# EAGLE design RFmodule (EAGLE 9.6.2)
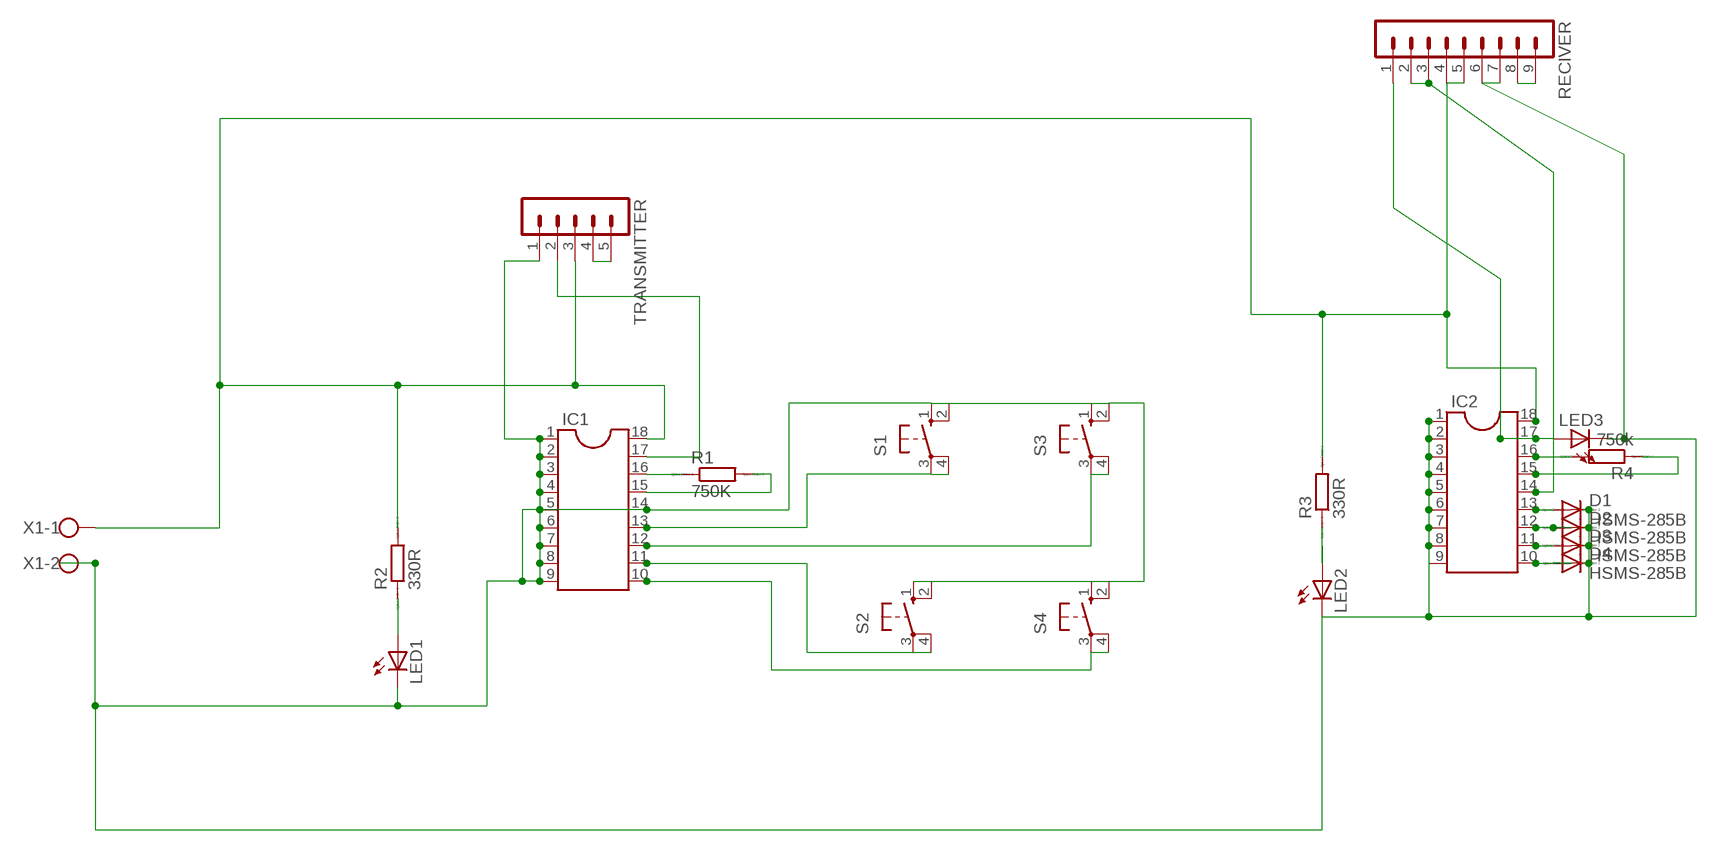
[diagram p0: schematic, sheet 1]

## Parts
D1  HSMS-285B  [SOT323]
D2  HSMS-285B  [SOT323]
D3  HSMS-285B  [SOT323]
D4  HSMS-285B  [SOT323]
IC1  DIL18  [DIL18]
IC2  DIL18  [DIL18]
LED1  LED5MM  [LED5MM]
LED2  LED5MM  [LED5MM]
LED3  LED5MM  [LED5MM]
R1  750K  R0207/10  [0207/10]
R2  330R  R0207/10  [0207/10]
R3  330R  R0204/7  [0204/7]
R4  750k  R0204/7  [0204/7]
RECIVER  MA09-1  [MA09-1]
S1  10-XX  [B3F-10XX]
S2  10-XX  [B3F-10XX]
S3  10-XX  [B3F-10XX]
S4  10-XX  [B3F-10XX]
TRANSMITTER  MA05-1  [MA05-1]
X1  W237-102  [W237-102]

## Nets
GND: D1.3(C) D2.3(C) D3.3(C) D4.3(C) IC1.1 IC1.2 IC1.3 IC1.4 IC1.5 IC1.6 IC1.7 IC1.8 IC1.9 IC1.14 IC2.1 IC2.2 IC2.3 IC2.4 IC2.5 IC2.6 IC2.7 IC2.8 IC2.9 LED1.K(C) LED2.K(C) LED3.K(C) RECIVER.6 RECIVER.7 S1.1(S) S1.2(S1) S2.1(S) S2.2(S1) S3.1(S) S3.2(S1) S4.1(S) S4.2(S1) TRANSMITTER.1 X1.2
N$1: LED2.A R3.1
N$2: IC1.13 S1.3(P) S1.4(P1)
N$3: LED1.A R2.1
N$4: IC1.16 R1.1
N$5: IC1.15 R1.2
N$6: IC1.11 S2.3(P) S2.4(P1)
N$8: D1.1(A) IC2.13
N$9: IC1.10 S4.3(P) S4.4(P1)
N$10: IC1.12 S3.3(P) S3.4(P1)
N$11: D2.1(A) IC2.12
N$12: D3.1(A) IC2.11
N$13: D4.1(A) IC2.10
N$14: TRANSMITTER.4 TRANSMITTER.5
N$15: IC1.17 TRANSMITTER.2
N$16: RECIVER.8 RECIVER.9
N$17: IC2.17 LED3.A RECIVER.1
N$18: IC2.16 R4.2
N$19: IC2.15 R4.1
N$21: IC2.14 RECIVER.2 RECIVER.3
VCC: IC1.18 IC2.18 R2.2 R3.2 RECIVER.4 RECIVER.5 TRANSMITTER.3 X1.1

## Library data of the parts
D1-D4 = avago:HSMS-285B: Surface Mount Microwave Schottky Detector Diodes Source: Data sheet <http://www.farnell.com/datasheets/461166.pdf>
IC1 IC2 = ic-package:DIL18: Dual In Line / Socket
LED1-LED3 = led:LED: LED OSRAM: - CHIPLED LG R971, LG N971, LY N971, LG Q971, LY Q971, LO R971, LY R971 LH N974, LH R974 LS Q976, LO Q976, LY Q976 LO Q996 - Hyper CHIPLED LW Q18S LB Q993, LB Q99A, LB R99A - SideLED LS A670, LO A670, LY A670, LG A670, LP A670 LB A673, LV A673, LT A673, LW A673 LH A674 LY A675 LS A676, LA A676, LO A676, LY A676, LW A676 LS A679, LY A679, LG A679 - Hyper Micro SIDELED® LS Y876, LA Y876, LO Y876, LY Y876 LT Y87S - SmartLED LW L88C, LW L88S LB L89C, LB L89S, LG L890 LS L89K, LO L89K, LY L89K LS L896, LA L896, LO L896, LY L896 - TOPLED LS T670, LO T670, LY T670, LG T670, LP T670 LSG T670, LSP T670, LSY T670, LOP T670, LYG T670 LG T671, LOG T671, LSG T671 LB T673, LV T673, LT T673, LW T673 LH T674 LS T676, LA T676, LO T676, LY T676, LB T676, LH T676, LSB T676, LW T676 LB T67C, LV T67C, LT T67C, LS T67K, LO T67K, LY T67K, LW E67C LS E67B, LA E67B, LO E67B, LY E67B, LB E67C, LV E67C, LT E67C LW T67C LS T679, LY T679, LG T679 LS T770, LO T770, LY T770, LG T770, LP T770 LB T773, LV T773, LT T773, LW T773 LH T774 LS E675, LA E675, LY E675, LS T675 LS T776, LA T776, LO T776, LY T776, LB T776 LHGB T686 LT T68C, LB T68C - Hyper Mini TOPLED® LB M676 - Mini TOPLED Santana® LG M470 LS M47K, LO M47K, LY M47K Source: http://www.osram.convergy.de LUXEON: - LUMILED® LXK2-PW12-R00, LXK2-PW12-S00, LXK2-PW14-U00, LXK2-PW14-V00 LXK2-PM12-R00, LXK2-PM12-S00, LXK2-PM14-U00 LXK2-PE12-Q00, LXK2-PE12-R00, LXK2-PE12-S00, LXK2-PE14-T00, LXK2-PE14-U00 LXK2-PB12-K00, LXK2-PB12-L00, LXK2-PB12-M00, LXK2-PB14-N00, LXK2-PB14-P00, LXK2-PB14-Q00 LXK2-PR12-L00, LXK2-PR12-M00, LXK2-PR14-Q00, LXK2-PR14-R00 LXK2-PD12-Q00, LXK2-PD12-R00, LXK2-PD12-S00 LXK2-PH12-R00, LXK2-PH12-S00 LXK2-PL12-P00, LXK2-PL12-Q00, LXK2-PL12-R00 Source: www.luxeon.com KINGBRIGHT: KA-3528ASYC Source: www.kingbright.com
R1-R4 = eagle-ltspice:R: RESISTOR, European symbol; SPICEMODEL: NONE; SPICEPREFIX: R
RECIVER = con-lstb:MA09-1: PIN HEADER; OC_FARNELL: unknown; OC_NEWARK: unknown
S1-S4 = switch-omron:10-XX: OMRON SWITCH; MPN: B3F-1000; OC_FARNELL: 176432; OC_NEWARK: 36M3542
TRANSMITTER = con-lstb:MA05-1: PIN HEADER; OC_FARNELL: unknown; OC_NEWARK: unknown
X1 = con-wago-500:W237-102: WAGO SCREW CLAMP; MPN: 237-102; OC_FARNELL: unknown; OC_NEWARK: 70K9898

## Board
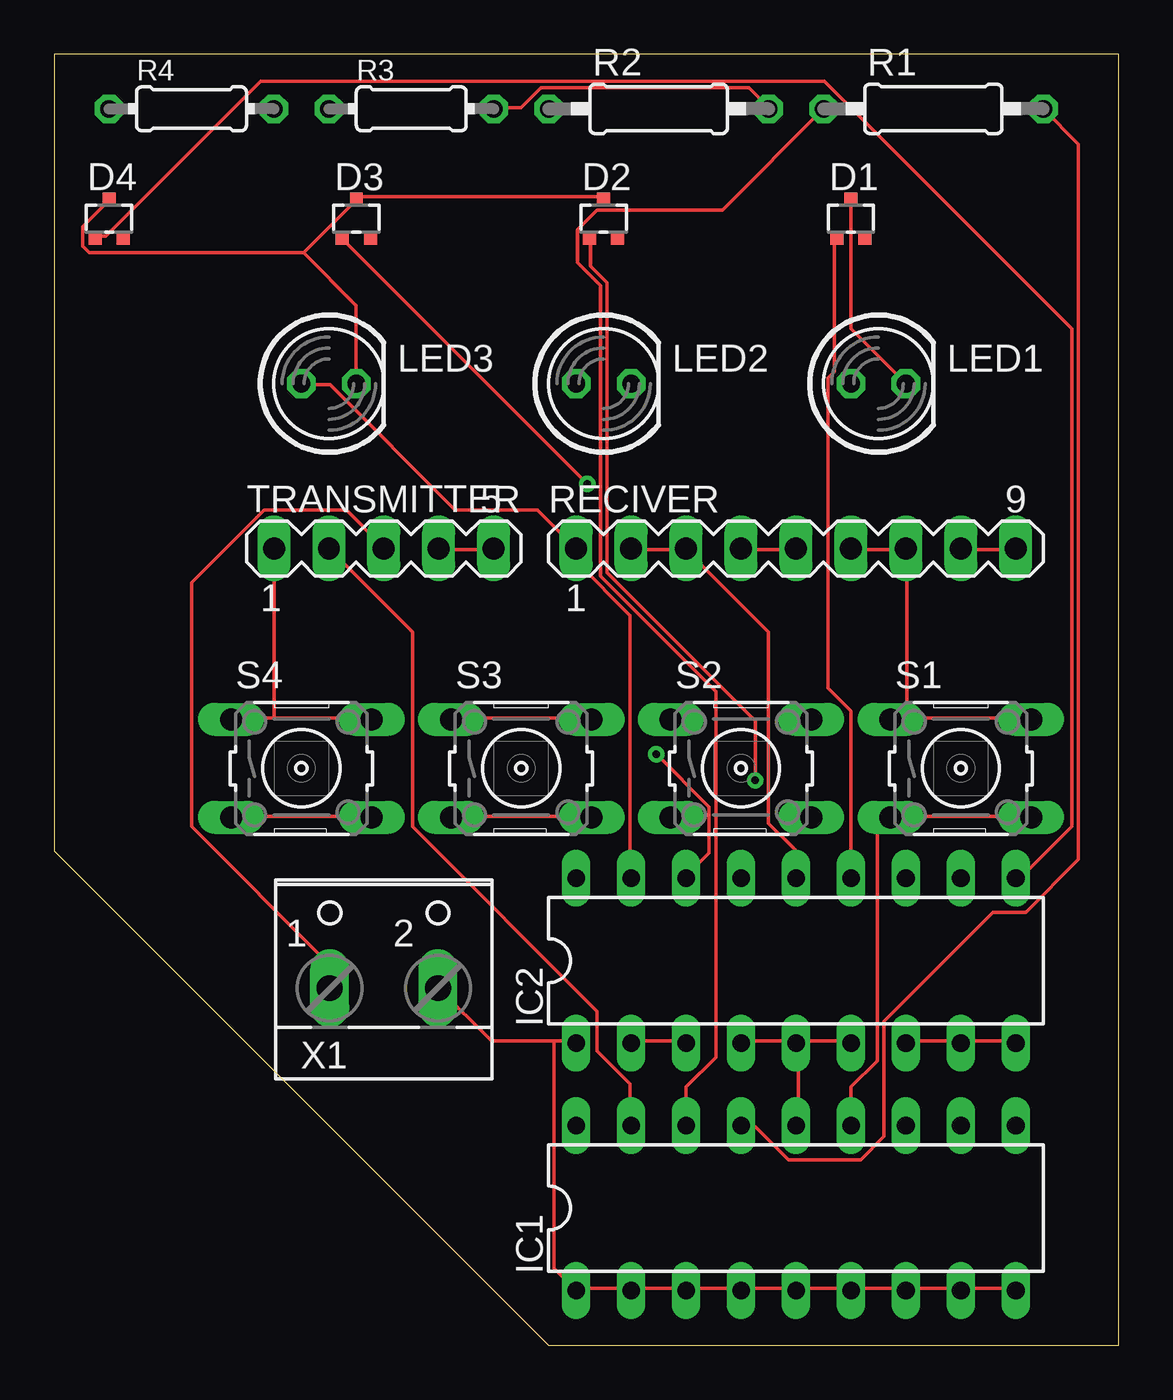
[diagram p1: board, top side]
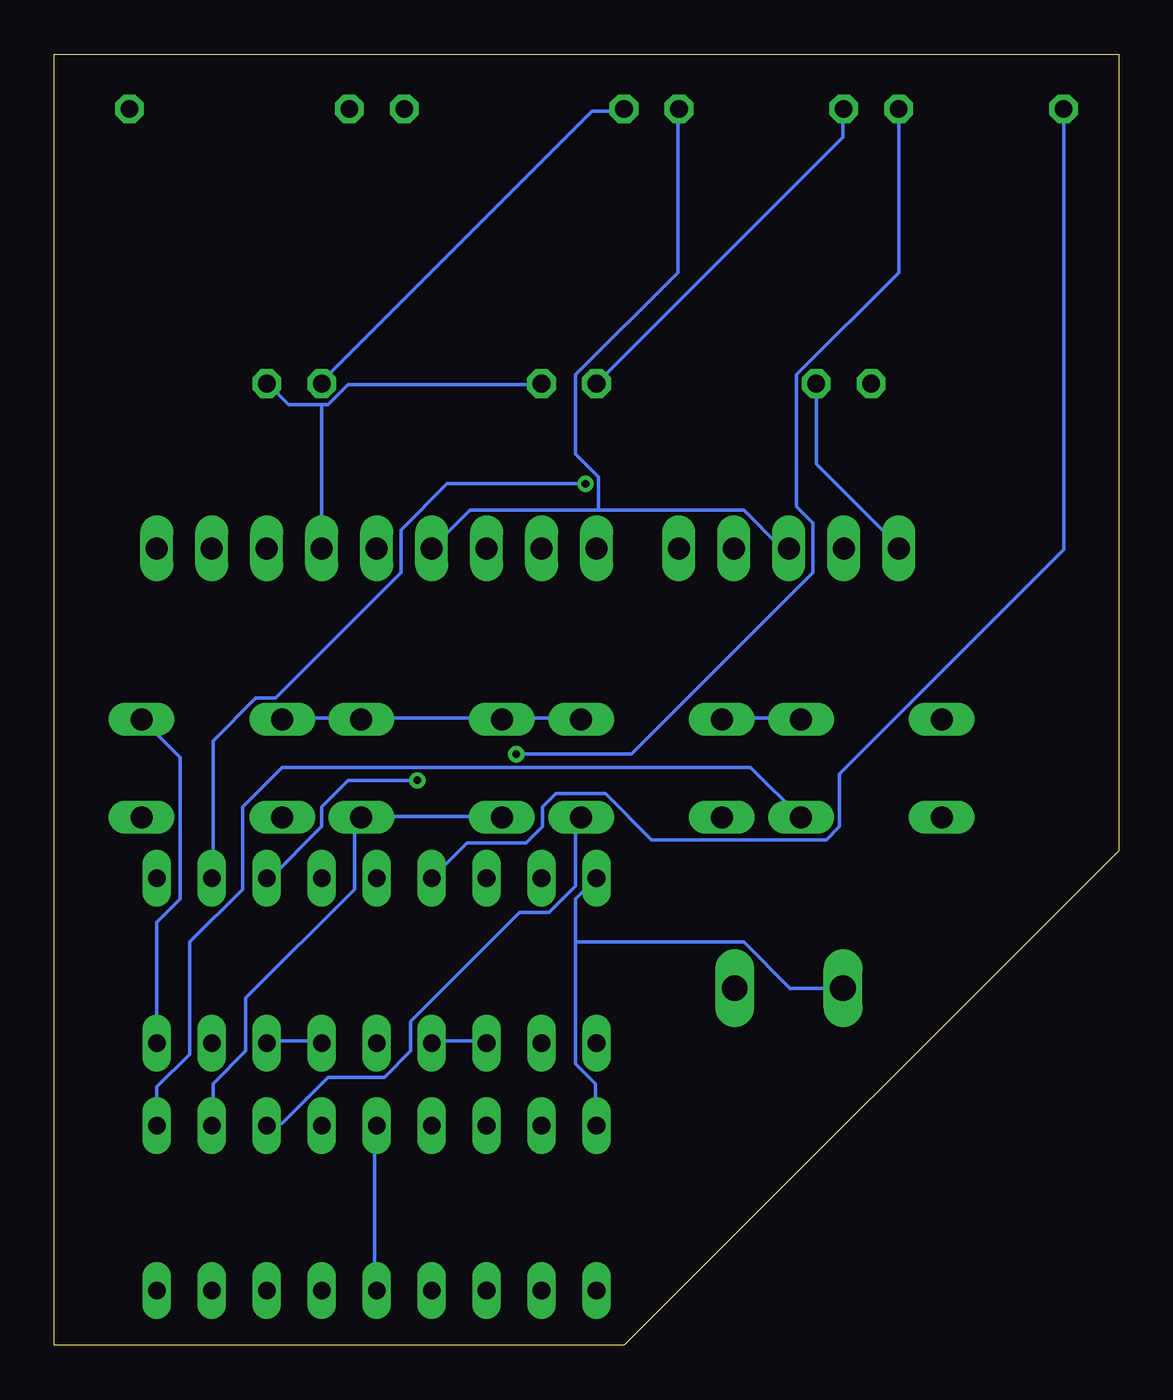
[diagram p2: board, bottom side, seen from below]

Size 49.2 x 59.68 mm. Coordinates in mm from the lower left corner, seen from the top.
Outline: 49.2,0 49.2,59.68 0,59.68 0,22.86 22.86,0 49.2,0
Copper layers (1*16): Top 0.035mm / dielectric 1.5mm / Bottom 0.035mm
Design rules "default": minimum track width 6mil, minimum drill 0.35mm, track to track 6mil, track to pad 6mil, pad to pad 6mil, via to via 6mil, smd to smd 6mil, copper to edge 40mil, drill to drill 6mil, minimum pad ring 10mil, minimum via ring 8mil, stop-mask expansion 4mil, vias tented up to drill 0mil, thermal gap 10mil

### Footprints (pad centres in the part's own frame; a part is rotated, then mirrored left to right if it is on the bottom)
SOT323 = smd 0.6 x 0.55: 1 -0.65,-0.925; 2 0.65,-0.925; 3 0,0.925
DIL18 = drill 0.813 long: 1 -10.16,-3.81; 2 -7.62,-3.81; 3 -5.08,-3.81; 4 -2.54,-3.81; 5 0,-3.81; 6 2.54,-3.81; 7 5.08,-3.81; 8 7.62,-3.81; 9 10.16,-3.81; 10 10.16,3.81; 11 7.62,3.81; 12 5.08,3.81; 13 2.54,3.81; 14 0,3.81; 15 -2.54,3.81; 16 -5.08,3.81; 17 -7.62,3.81; 18 -10.16,3.81
LED5MM = drill 0.813 octagon: A -1.27,0; K 1.27,0
0207/10 = drill 0.813 octagon: 1 -5.08,0; 2 5.08,0
0204/7 = drill 0.813 octagon: 1 -3.81,0; 2 3.81,0
MA09-1 = drill 1.016 long: 1 -10.16,0; 2 -7.62,0; 3 -5.08,0; 4 -2.54,0; 5 0,0; 6 2.54,0; 7 5.08,0; 8 7.62,0; 9 10.16,0
B3F-10XX = drill 1.016 long: 1 -3.251,2.261; 2 3.251,2.261; 3 -3.251,-2.261; 4 3.251,-2.261
MA05-1 = drill 1.016 long: 1 -5.08,0; 2 -2.54,0; 3 0,0; 4 2.54,0; 5 5.08,0
W237-102 = drill 1.194 long: 1 -2.5,-1.27; 2 2.5,-1.27

### Placement (x,y rotation side)
D1  36.83,52.07 0 top
D2  25.4,52.07 0 top
D3  13.97,52.07 0 top
D4  2.54,52.07 0 top
IC1  34.29,6.35 0 top
IC2  34.29,17.78 0 top
LED1  38.1,44.45 0 top
LED2  25.4,44.45 0 top
LED3  12.7,44.45 0 top
R1  40.64,57.15 0 top
R2  27.94,57.15 0 top
R3  16.51,57.15 0 top
R4  6.35,57.15 0 top
RECIVER  34.29,36.83 0 top
S1  41.91,26.67 0 top
S2  31.75,26.67 0 top
S3  21.59,26.67 0 top
S4  11.43,26.67 0 top
TRANSMITTER  15.24,36.83 0 top
X1  15.24,17.78 0 top

### Tracks (layer width: path | path; a pad name or v marks a point on that pad's centre or on a via)
GND
  Top 0.152: IC2.7 39.42,14.07 41.86,14.07 IC2.8 42.01,14.07 44.45,14.07 IC2.9 | IC2.2 26.77,14.07 29.21,14.07 IC2.3 | IC1.14 34.39,10.26 34.39,13.92 IC2.5 | IC2.4 31.8,14.07 34.24,14.07 IC2.5 | IC2.6 36.83,14.07 34.39,14.07 IC2.5 | 23.11,14.07 20.22,14.07 17.78,16.51 X1.2 | 23.11,14.07 24.03,14.07 IC2.1 | IC1.9 44.45,2.64 42.01,2.64 IC1.8 41.86,2.64 39.42,2.64 IC1.7 39.27,2.64 36.83,2.64 | 29.21,2.64 26.77,2.64 IC1.2 26.62,2.64 24.18,2.64 IC1.1 23.11,3.56 23.11,14.07 | 36.83,2.64 34.39,2.64 IC1.5 34.24,2.64 31.8,2.64 IC1.4 31.65,2.64 29.21,2.64 | 29.21,2.64 IC1.3 | 36.83,2.64 IC1.6 | RECIVER.6 36.83,36.78 39.27,36.78 RECIVER.7 39.42,36.78 39.42,29.01 | D1.3 36.83,46.99 LED1.K | 11.53,50.49 1.63,50.49 1.32,50.8 1.32,51.71 2.54,52.93 D4.3 | 11.53,50.49 13.97,52.93 D3.3 13.97,53.09 25.4,53.09 D2.3 | LED3.K 13.97,48.06 11.53,50.49 | 39.42,29.01 38.66,29.01 S1.1 39.42,29.01 | 39.42,29.01 45.06,29.01 S1.2 | 10.16,29.01 14.58,29.01 S4.2 | 10.16,29.01 8.18,29.01 S4.1 | 10.16,29.01 TRANSMITTER.1 | S3.2 24.79,29.01 18.39,29.01 S3.1
  Bottom 0.152: IC2.3 29.21,14.07 31.65,14.07 IC2.4 | IC2.7 39.27,14.07 36.83,14.07 IC2.6 | IC1.14 34.39,10.11 34.39,2.64 IC1.5 | 36.83,43.49 38.35,43.49 39.27,44.4 LED1.K | 36.83,43.49 36.52,43.49 35.61,44.4 26.77,44.4 LED2.K | 36.83,43.49 RECIVER.6 | 35,29.01 38.66,29.01 S1.1 | S3.2 24.94,29.01 28.45,29.01 S2.1 28.6,29.01 35,29.01 | S3.1 18.24,29.01 14.73,29.01 S4.2 | 35,29.01 S2.2 | LED3.K 13.97,40.74 10.16,36.93 TRANSMITTER.1 | IC2.9 44.45,19.56 43.38,20.62 43.38,27.18 45.06,28.85 S1.2
N$1
  Bottom 0.152: LED2.A 12.75,55.83 12.75,57.05 R3.1
N$2
  Top 0.152: IC1.13 36.83,11.94 38.05,13.16 38.05,23.67 38.66,24.28 S1.3 38.66,24.43 45.06,24.43 S1.4
N$3
  Bottom 0.152: R2.1 22.96,57.05 24.33,57.05 36.83,44.55 LED1.A
N$4
  Top 0.152: IC1.16 29.21,11.94 30.58,13.31 30.58,30.23 25.25,35.56 25.25,48.97 24.18,50.04 24.18,51.56 25.09,52.48 30.89,52.48 R1.1
N$5
  Top 0.152: R1.2 47.35,55.52 47.35,22.45 44.91,20.02 43.38,20.02 38.35,14.99 38.35,9.65 37.29,8.59 33.93,8.59 32.41,10.11 31.8,10.11 IC1.15
N$6
  Bottom 0.152: IC1.11 41.86,10.26 41.86,12.09 40.34,13.61 40.34,16.05 35.31,21.08 35.31,23.98 35,24.28 S2.4 35,24.43 28.6,24.43 S2.3
N$8
  Top 0.152: IC2.13 36.83,29.31 35.76,30.38 35.76,44.7 36.07,45.01 36.07,51.1 D1.1
N$9
  Top 0.152: S4.3 8.18,24.43 14.58,24.43 S4.4
  Bottom 0.152: IC1.10 44.45,11.94 42.93,13.46 42.93,18.64 40.49,21.08 40.49,24.89 38.66,26.72 17.02,26.72 14.73,24.43 S4.4
N$10
  Top 0.152: S3.3 18.39,24.43 24.79,24.43 S3.4
  Bottom 0.152: IC1.12 39.27,10.26 38.66,10.26 36.52,12.4 33.93,12.4 32.71,13.61 32.71,14.99 27.69,20.02 26.31,20.02 25.09,21.23 25.09,24.13 24.94,24.28 S3.4
N$11  (via drill 0.35)
  Top 0.152: v32.41,26.11 32.41,28.85 25.55,35.71 25.55,49.12 24.79,49.89 24.79,51.1 D2.1
  Bottom 0.152: v32.41,26.11 35.61,26.11 36.83,24.89 36.83,23.98 39.27,21.54 IC2.12
N$12  (via drill 0.35)
  Top 0.152: v24.64,39.83 13.36,51.1 D3.1
  Bottom 0.152: v24.64,39.83 31.04,39.83 33.17,37.69 33.17,35.71 38.96,29.92 39.88,29.92 41.86,27.94 41.86,21.69 IC2.11
N$13
  Top 0.152: D4.1 1.93,51.26 2.39,51.26 9.55,58.42 35.61,58.42 47.04,46.99 47.04,23.98 44.76,21.69 44.45,21.69 IC2.10
N$14
  Top 0.152: TRANSMITTER.4 17.78,36.78 20.22,36.78 TRANSMITTER.5
N$15
  Top 0.152: TRANSMITTER.2 16.56,32.97 16.56,23.98 25.09,15.44 25.09,13.61 26.62,12.09 26.62,10.26 IC1.17
N$16
  Top 0.152: RECIVER.8 42.01,36.78 44.45,36.78 RECIVER.9
N$17
  Top 0.152: LED3.A 11.53,44.4 12.75,44.4 18.54,38.61 22.35,38.61 RECIVER.1 24.18,36.78 24.18,36.17 26.62,33.73 26.62,21.69 IC2.17
N$18  (via drill 0.35)
  Top 0.152: v27.84,27.33 30.28,24.89 30.28,22.76 29.21,21.69 IC2.16
  Bottom 0.152: R4.2 10.16,49.58 14.88,44.86 14.88,38.76 14.12,38 14.12,35.71 22.5,27.33 v27.84,27.33
N$19
  Bottom 0.152: R4.1 2.54,36.78 12.9,26.42 12.9,23.98 13.51,23.37 21.59,23.37 23.72,25.5 26.01,25.5 26.62,24.89 26.62,23.98 27.38,23.22 30.12,23.22 IC2.15
N$21
  Top 0.152: 29.21,36.78 33.02,32.97 33.02,24.13 34.24,22.91 34.24,21.69 IC2.14 | 29.21,36.78 26.77,36.78 RECIVER.2 | 29.21,36.78 RECIVER.3
VCC
  Top 0.152: R3.2 20.37,57.2 21.59,57.2 22.5,58.12 32.11,58.12 33.02,57.2 R2.2 | RECIVER.5 34.24,36.78 31.8,36.78 RECIVER.4 | X1.1 12.6,16.51 12.6,17.73 6.35,23.98 6.35,35.26 9.7,38.61 13.51,38.61 15.19,36.93 TRANSMITTER.3
  Bottom 0.152: 25.09,18.64 25.09,20.62 IC2.18 | 25.09,18.64 25.09,13.01 24.18,12.09 24.18,10.26 IC1.18 | X1.1 15.19,16.51 17.32,18.64 25.09,18.64 | 24.03,38.61 29.97,38.61 RECIVER.4 | 24.03,38.61 17.32,38.61 15.65,36.93 15.34,36.93 TRANSMITTER.3 | 24.03,38.61 24.03,40.13 25.09,41.2 25.09,44.86 20.37,49.58 20.37,57.05 R3.2